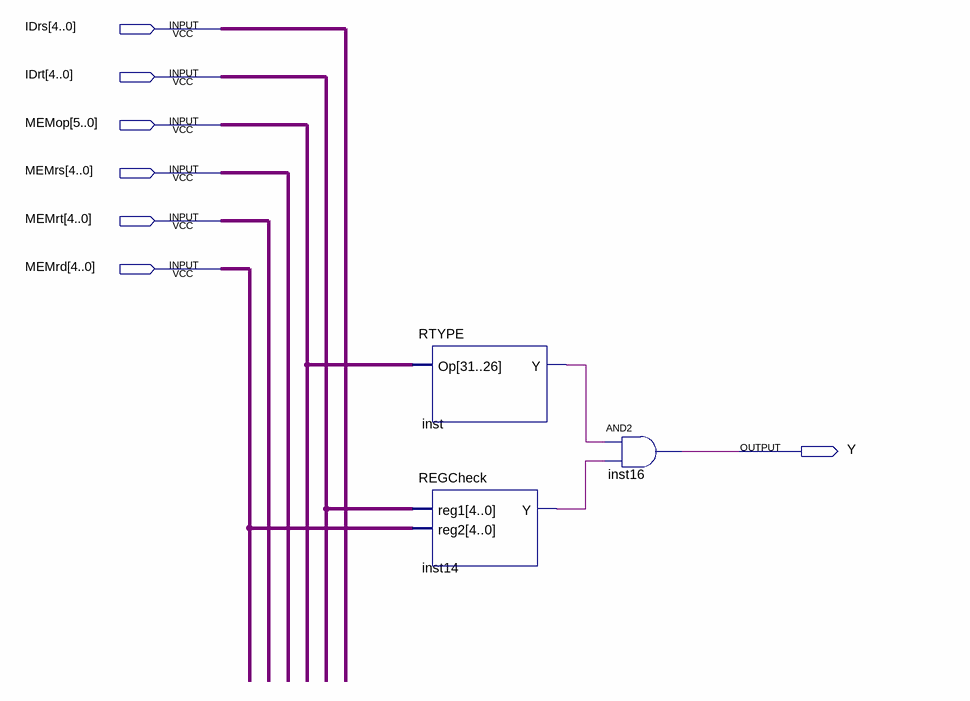
[diagram p0: schematic sheet]
// Quartus schematic ForwardBfromMEMtoID.bdf as structural Verilog: 3 symbols, 7 pins
module ForwardBfromMEMtoID (
  input  [4:0] IDrs,
  input  [4:0] IDrt,
  input  [5:0] MEMop,
  input  [4:0] MEMrs,
  input  [4:0] MEMrt,
  input  [4:0] MEMrd,
  output Y
);

  wire inst14_y, inst_y;

  RTYPE inst (.Op(MEMop), .Y(inst_y));
  REGCheck inst14 (.reg1(IDrt), .reg2(MEMrd), .Y(inst14_y));
  and inst16 (Y, inst_y, inst14_y);
endmodule
